# EAGLE design DueShieldTopOnly (EAGLE 8.0.1)
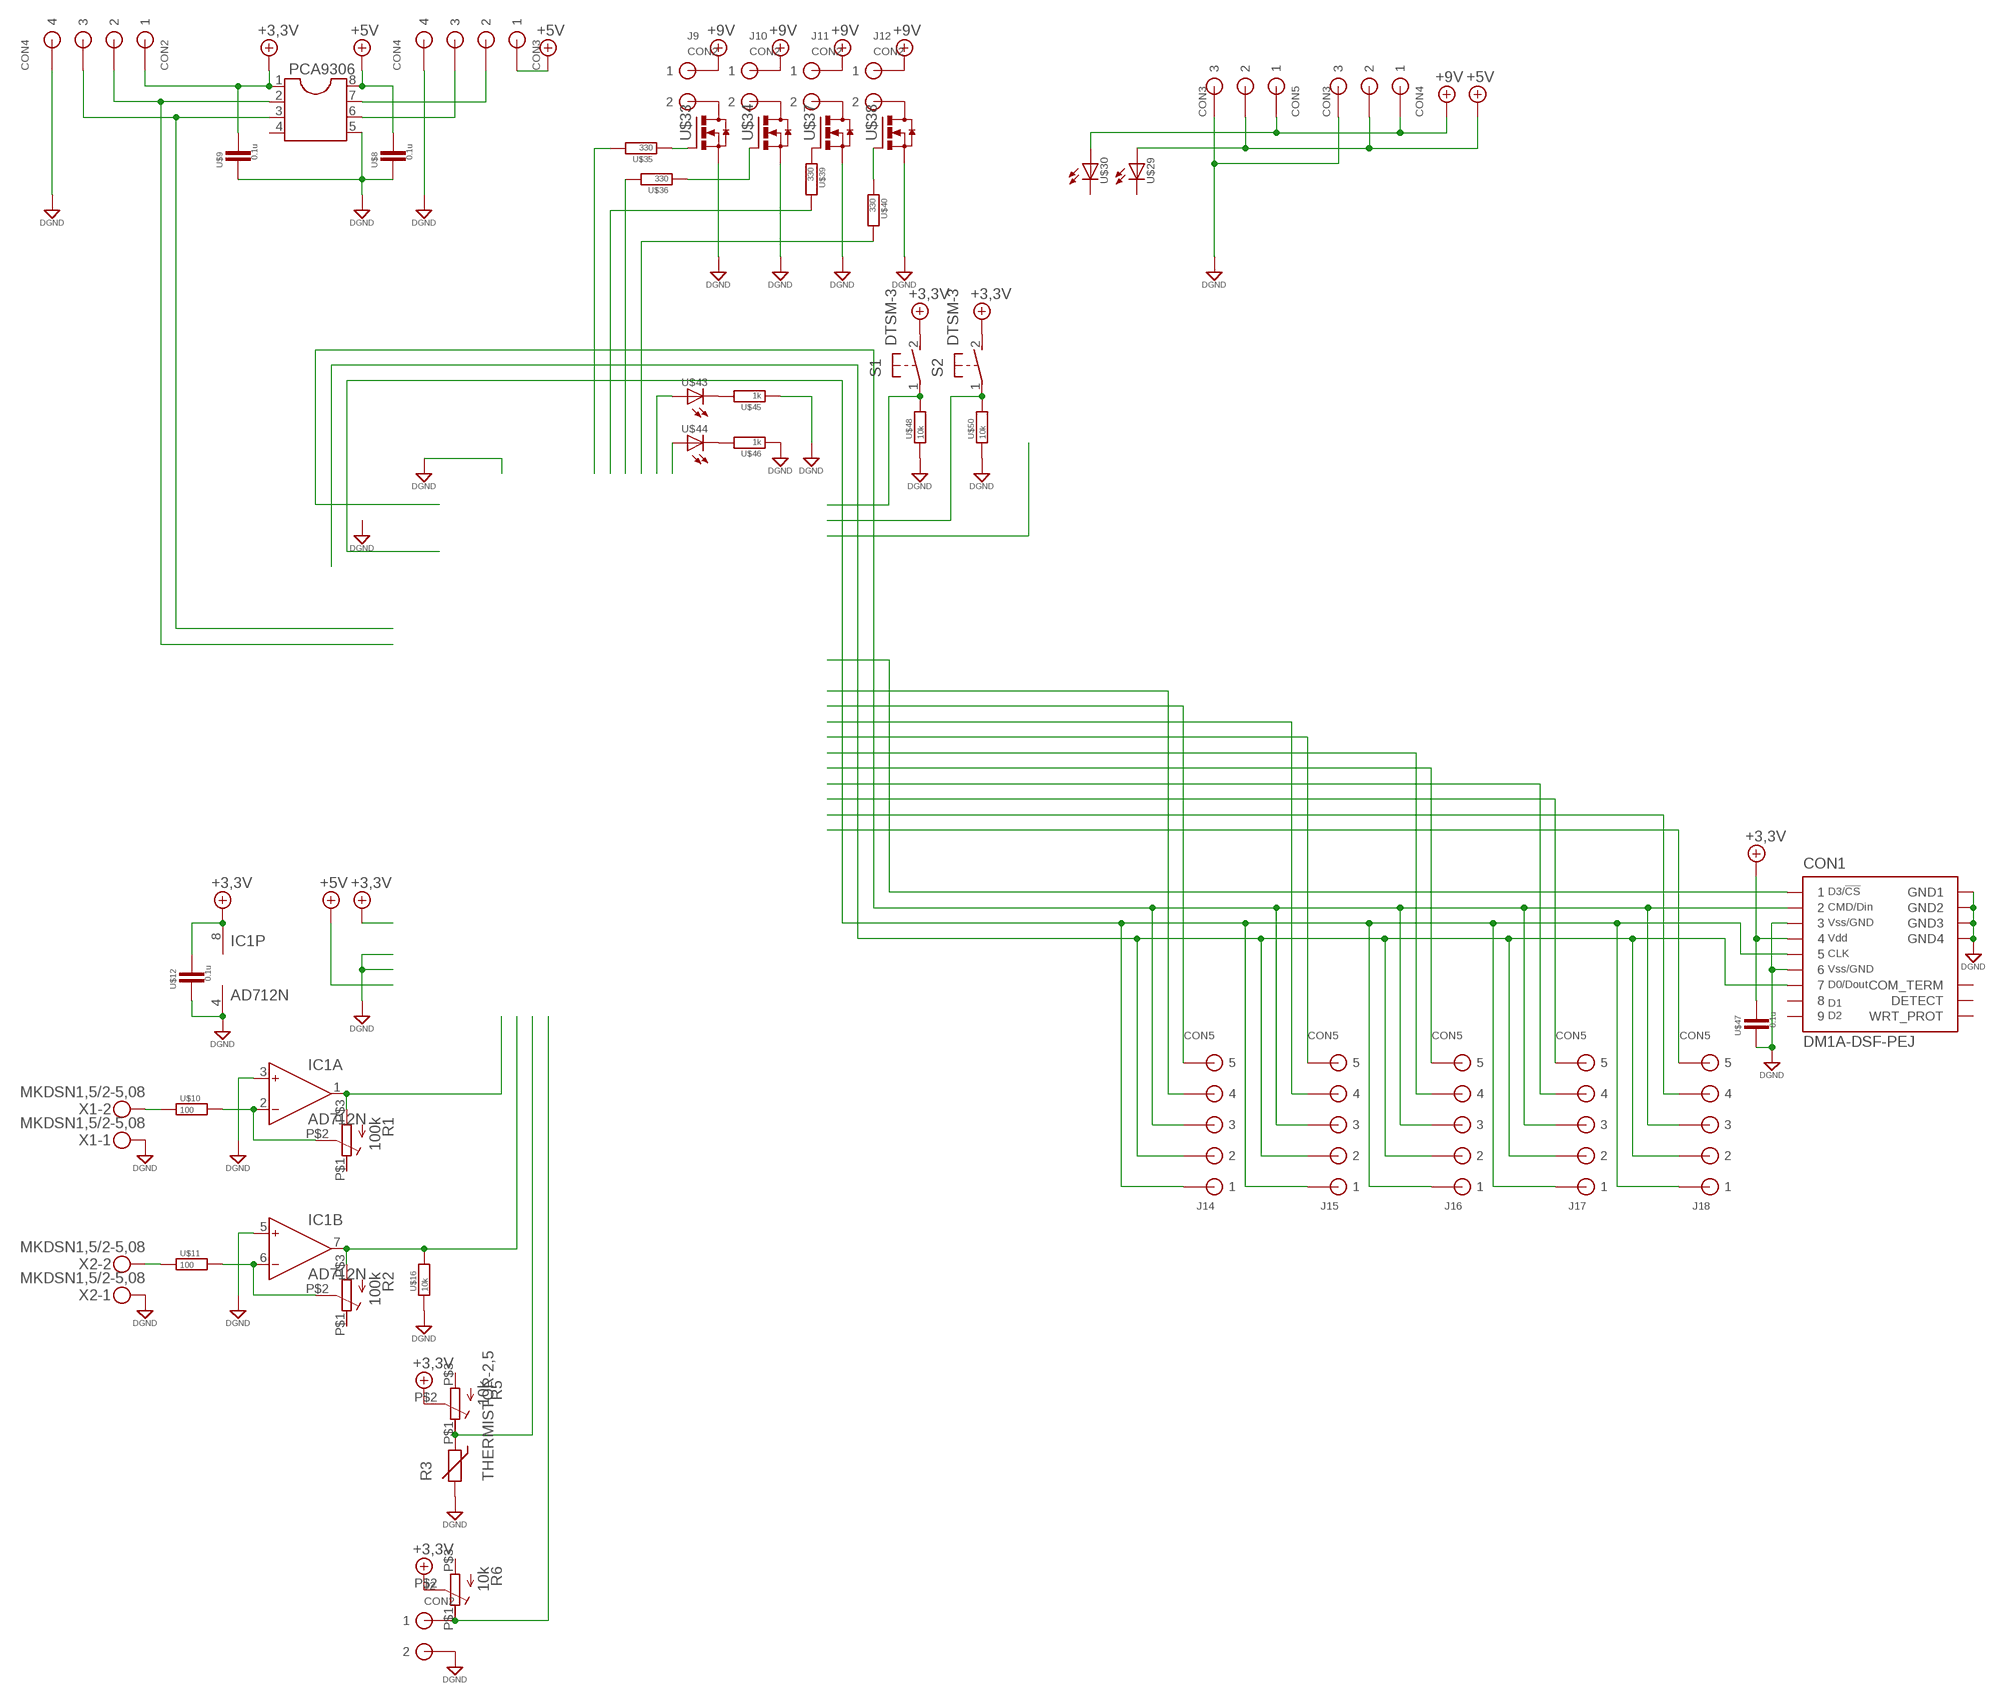
[diagram p0: schematic, sheet 1]

## Parts
CON1  DM1A-DSF-PEJ  [DM1A-DSF-PEJ]
CON2  CON4  [CON4]
CON3  CON4  [CON4]
CON4  CON3  [CON3]
CON5  CON3  [CON3]
IC1  AD712N  [DIL08]
J2  CON2  [CON2]
J9  CON2  [CON2]
J10  CON2  [CON2]
J11  CON2  [CON2]
J12  CON2  [CON2]
J14  CON5  [CON5]
J15  CON5  [CON5]
J16  CON5  [CON5]
J17  CON5  [CON5]
J18  CON5  [CON5]
PCA9306  DIL8  [DIL08]
R1  100k  抵抗(可変)  [GF063PB]
R2  100k  抵抗(可変)  [GF063PB]
R3  THERMISTOR-2,5  [RS-2,5]
R5  10k  抵抗(可変)  [GF063PB]
R6  10k  抵抗(可変)  [GF063PB]
S1  DTSM-3  [DTSM-3]
S2  DTSM-3  [DTSM-3]
U$8  0.1u  コンデンサ0805  [0805]
U$9  0.1u  コンデンサ0805  [0805]
U$10  100  抵抗0805  [0805]
U$11  100  抵抗0805  [0805]
U$12  0.1u  コンデンサ0805  [0805]
U$16  10k  抵抗0805  [0805]
U$29  LED(砲弾型)3  [LED3MM]
U$30  LED(砲弾型)3  [LED3MM]
U$33  TO-252(MOS-FET_N)  [TO-252]
U$34  TO-252(MOS-FET_N)  [TO-252]
U$35  330  抵抗0805  [0805]
U$36  330  抵抗0805  [0805]
U$37  TO-252(MOS-FET_N)  [TO-252]
U$38  TO-252(MOS-FET_N)  [TO-252]
U$39  330  抵抗0805  [0805]
U$40  330  抵抗0805  [0805]
U$43  LED(砲弾型)3  [LED3MM]
U$44  LED(砲弾型)3  [LED3MM]
U$45  1k  抵抗0805  [0805]
U$46  1k  抵抗0805  [0805]
U$47  0.1u  コンデンサ0805  [0805]
U$48  10k  抵抗0805  [0805]
U$50  10k  抵抗0805  [0805]
X1  MKDSN1,5/2-5,08  [MKDSN1,5/2-5,08]
X2  MKDSN1,5/2-5,08  [MKDSN1,5/2-5,08]

## Nets
+3.3V: CON1.4 CON2.P$1 IC1.8(P:V+) PCA9306.1 R5.P$2(S) R6.P$2(S) S1.2 S2.2 U$9.1 U$12.1 U$47.1 ; supply symbol labelled +3,3V
+5V: CON3.P$1 CON4.P$2 CON5.P$2 PCA9306.8 U$8.1 U$29.A
+5V1: U$43.A
+9V: CON4.P$1 CON5.P$1 J9.P$1 J10.P$1 J11.P$1 J12.P$1 U$30.A
+9V1: U$44.A
DGND: CON1.3 CON1.6 CON1.GND1 CON1.GND2 CON1.GND3 CON1.GND4 CON2.P$4 CON3.P$4 CON4.P$3 CON5.P$3 IC1.3(A:IN+) IC1.4(P:V-) IC1.5(B:IN+) J2.P$2 PCA9306.5 R3.2 U$8.2 U$9.2 U$12.2 U$16.1 U$33.2(S) U$34.2(S) U$37.2(S) U$38.2(S) U$45.1 U$46.1 U$47.2 U$48.1 U$50.1 X1.1 X2.1
N$2: CON1.7 J14.P$2 J15.P$2 J16.P$2 J17.P$2 J18.P$2
N$3: S1.1 U$48.2
N$4: CON1.1
N$5: CON2.P$2 PCA9306.2
N$6: CON1.5 J14.P$1 J15.P$1 J16.P$1 J17.P$1 J18.P$1
N$7: CON2.P$3 PCA9306.3
N$8: CON3.P$2 PCA9306.7
N$9: CON3.P$3 PCA9306.6
N$10: IC1.2(A:IN-) R1.P$2(S) U$10.2
N$11: IC1.6(B:IN-) R2.P$2(S) U$11.2
N$13: U$11.1 X2.2
N$14: U$10.1 X1.2
N$15: J2.P$1 R6.P$1(E)
N$17: IC1.1(A:OUT) R1.P$3(A)
N$18: IC1.7(B:OUT) R2.P$3(A) U$16.2
N$19: R3.1 R5.P$1(E)
N$25: U$35.2
N$26: U$36.2
N$27: U$39.2
N$28: U$40.2
N$31: U$43.K U$45.2
N$32: U$33.1(G) U$35.1
N$33: U$34.1(G) U$36.1
N$34: J9.P$2 U$33.3(D)
N$35: J10.P$2 U$34.3(D)
N$36: U$37.1(G) U$39.1
N$37: U$38.1(G) U$40.1
N$38: J11.P$2 U$37.3(D)
N$39: J12.P$2 U$38.3(D)
N$40: U$44.K U$46.2
N$41: J14.P$4
N$42: J14.P$5
N$43: CON1.2 J14.P$3 J15.P$3 J16.P$3 J17.P$3 J18.P$3
N$44: S2.1 U$50.2
N$46: J15.P$5
N$48: J15.P$4
N$50: J16.P$4
N$51: J16.P$5
N$55: J17.P$4
N$56: J17.P$5
N$60: J18.P$4
N$61: J18.P$5
Unconnected: CON1.8 CON1.9 CON1.COM_TERM CON1.DETECT CON1.WRT_PROT PCA9306.4 R1.P$1(E) R2.P$1(E) R5.P$3(A) R6.P$3(A) U$29.K U$30.K

## Library data of the parts
CON1 = (スロット)SDカード:DM1A-DSF-PEJ: HIROSE DM1A
CON2 CON3 = (コネクタ)XH:CON4: Low insertion connector 4pin
CON4 CON5 = (コネクタ)XH:CON3: low insertion CON
IC1 = analog-devices:AD712: Dual Precision, Low Cost, High Speed BiFET Op Amp Source: http://www.analog.com/static/imported-files/data_sheets/AD712.pdf; MF: ALTERA CORPORATION; MPN: AD712JNZ; OC_FARNELL: 9604898; OC_NEWARK: 59K4554
J2 J9-J12 = (コネクタ)XH:CON2: low insertion CON
J14-J18 = (コネクタ)XH:CON5: Low insertion connector 5P
PCA9306 = (半導体)汎用DIP:DIL8: Dual In Line / Socket
R1 R2 R5 R6 = (抵抗)可変抵抗:抵抗(可変): Trimm resistor
R3 = varistor:THERMISTOR: THERMISTOR
S1 S2 = (スイッチ)タクトスイッチ2:DTSM-3
U$8 U$9 U$12 U$47 = (Foundation)表面実装RC:コンデンサ
U$10 U$11 U$16 U$35 U$36 U$39 U$40 U$45 U$46 U$48 U$50 = (Foundation)表面実装RC:抵抗
U$29 U$30 U$43 U$44 = (半導体)LED:LED(砲弾型)
U$33 U$34 U$37 U$38 = (半導体)FET＆トランジスタ:TO-252(MOS-FET_N)
X1 X2 = con-phoenix-508:MKDSN1,5/2-5,08: MKDSN 1,5/ 2-5,08 Printklemme Nennstrom: 13,5 A Nennspannung: 250 V Rastermaß: 5,08 mm Polzahl: 2 Anschlussart: Schraubanschluss Montage: Löten Anschlussrichtung Leiter/Platine: 0 ° Artikelnummer: 1729128 Source: http://eshop.phoenixcontact.com .. 1729128.pdf

## Board
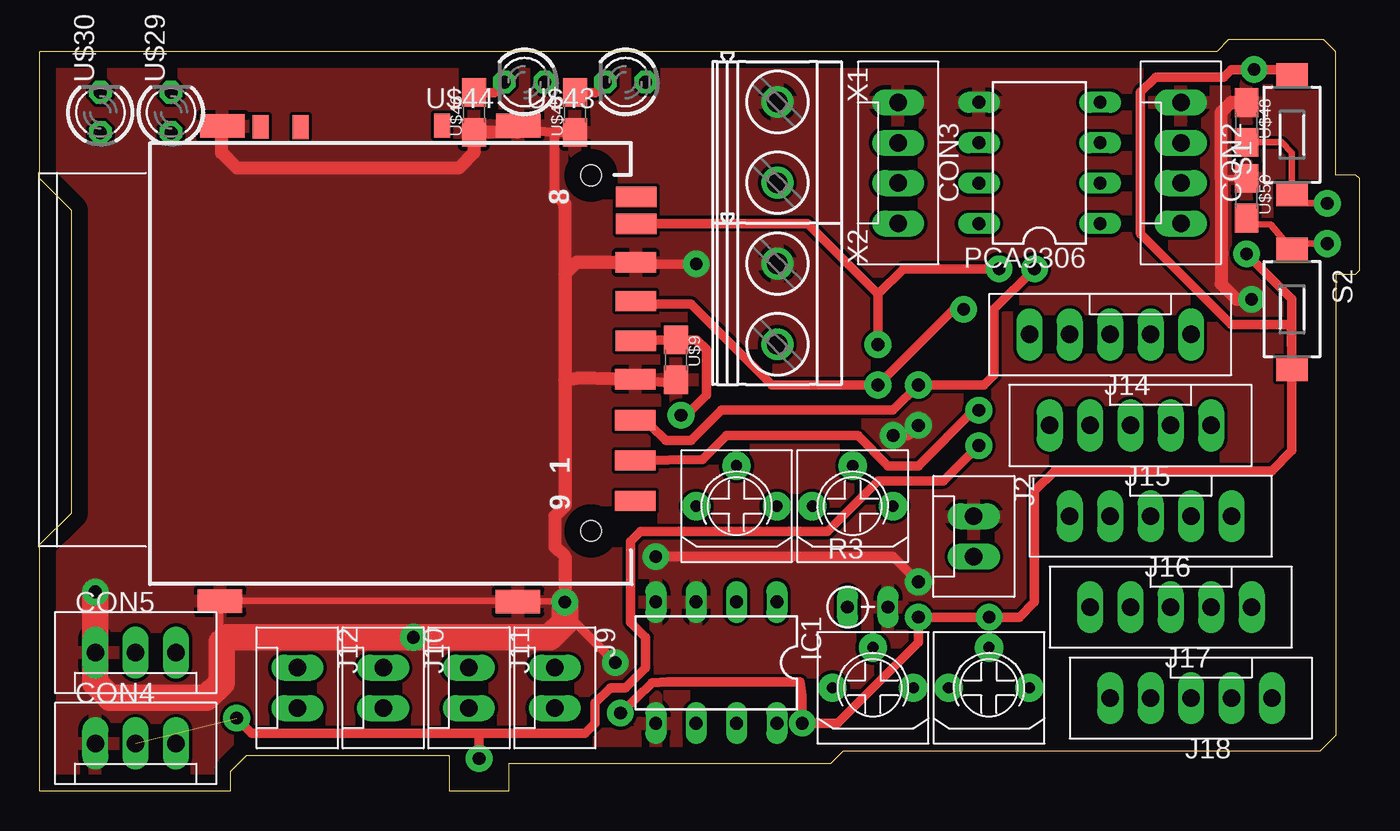
[diagram p1: board, top side]
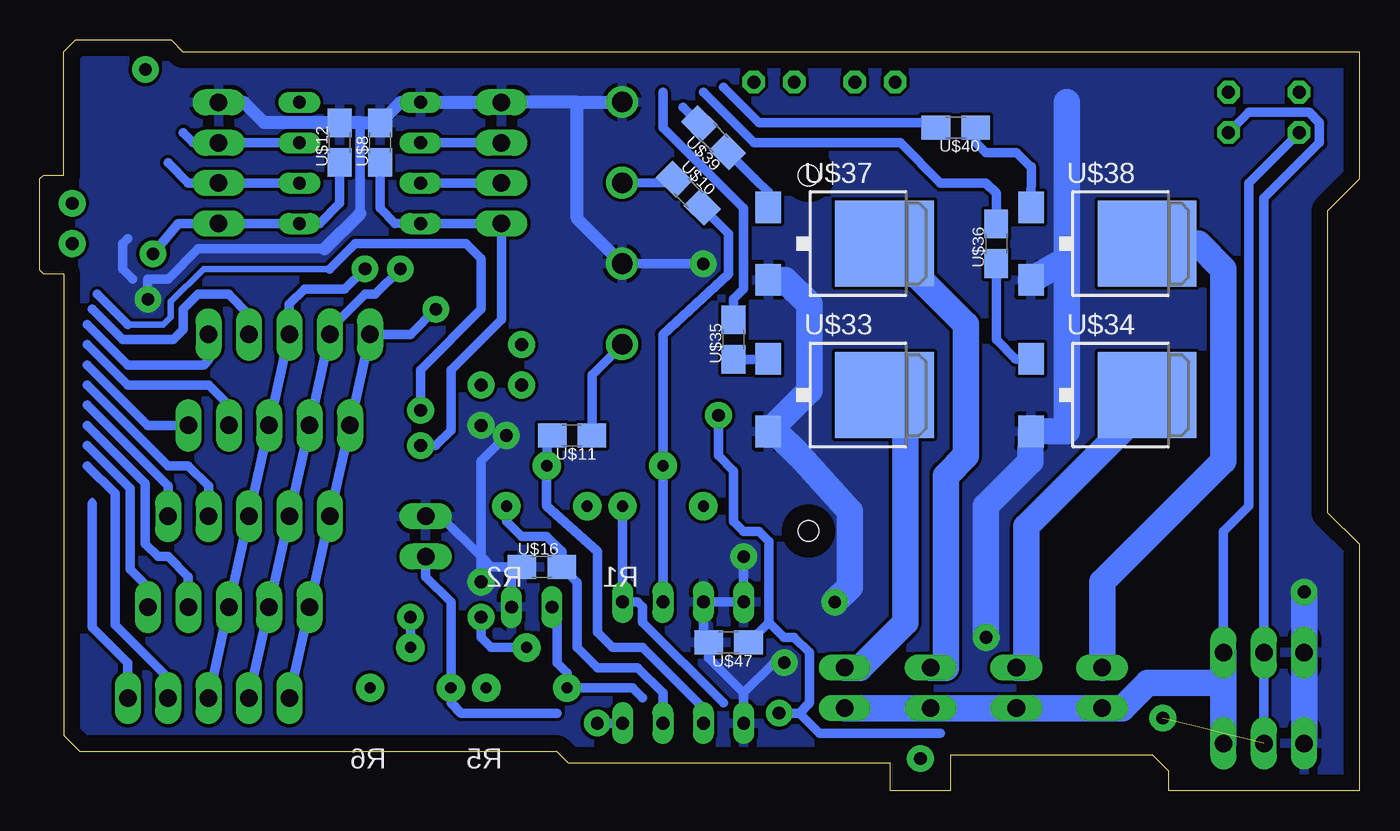
[diagram p2: board, bottom side, seen from below]

Size 83 x 47.25 mm. Coordinates in mm from the lower left corner, seen from the top.
Outline: 0,0 0,15.5 2,17.5 2,36.5 0,38.5 0,46.5 74,46.5 74.75,47.25 80.75,47.25 81.5,46.5 81.5,38.75 82.75,38.75 83,38.5 83,32.75 82.75,32.5 81.5,32.5 81.5,3.5 80.5,2.5 50.5,2.5 49.75,1.75 29.5,1.75 29.5,0 25.75,0 25.75,2.25 13,2.25 12,1.25 12,0 0,0
Copper layers (1*16): Top 0.035mm / dielectric 1.5mm / Bottom 0.035mm
Design rules "default": minimum track width 10mil, minimum drill 24mil, track to track 8mil, track to pad 8mil, pad to pad 8mil, via to via 8mil, smd to smd 8mil, copper to edge 40mil, drill to drill 8mil, minimum pad ring 10mil, minimum via ring 8mil, stop-mask expansion 4mil, vias tented up to drill 0mil, thermal gap 10mil

### Footprints (pad centres in the part's own frame; a part is rotated, then mirrored left to right if it is on the bottom)
DM1A-DSF-PEJ = smd 1.27 x 2.54: 1 6.013,16.809; 2 3.488,16.809; 3 0.911,16.813; 4 -1.516,16.84; 5 -4.016,16.84; 6 -6.44,16.84; 7 -8.865,16.866; 8 -10.565,16.866; 9 8.564,16.809 | smd 1.5 x 1: COM_TERM -14.962,-6.752; DETECT -15.032,4.652; WRT_PROT -14.937,-4.238 | smd 1.5 x 2.8: GND1 14.895,9.427; GND2 -15.049,9.452; GND3 -15.023,-9.152; GND4 14.859,-9.305 | hole 1.295: -11.913,14.021; 10.439,14.021
CON4 = drill 1.1 long: P$1 3.81,0; P$2 1.27,0; P$3 -1.27,0; P$4 -3.81,0
CON3 = drill 1.1 long: P$1 2.54,0; P$2 0,0; P$3 -2.54,0
DIL08 = drill 0.813 long: 1 -3.81,-3.81; 2 -1.27,-3.81; 3 1.27,-3.81; 4 3.81,-3.81; 5 3.81,3.81; 6 1.27,3.81; 7 -1.27,3.81; 8 -3.81,3.81
CON2 = drill 1.1 long: P$1 1.27,0; P$2 -1.27,0
CON5 = drill 1.1 long: P$1 5.08,0; P$2 2.54,0; P$3 0,0; P$4 -2.54,0; P$5 -5.08,0
GF063PB = drill 0.7 pad 1.778: P$1 0,2.54; P$2 2.54,0; P$3 0,-2.54
RS-2,5 = drill 0.813 long: 1 -1.27,0; 2 1.27,0
DTSM-3 = smd 1.5 x 2: 1 -3.75,0; 2 3.75,0
0805 = smd 1.8 x 1.5: 1 -1.25,0; 2 1.25,0
LED3MM = drill 0.813 pad 1.422 octagon: A -1.27,0; K 1.27,0
TO-252 = smd 2 x 1.6: 1 -2.28,-4.8; 2 2.28,-4.8 | smd 5.4 x 6.2: 3 0,2.5
MKDSN1,5/2-5,08 = drill 1.3 pad 2: 1 -2.561,0.025; 2 2.519,0.025

### Placement (x,y rotation side)
CON1  20.64,26.8 270 top
CON2  71.75,39.51 270 top
CON3  53.98,39.51 270 top
CON4  6.03,2.99 0 top
CON5  6.03,8.71 0 top
IC1  42.55,8.07 180 top
J2  58.74,16.01 270 top
J9  32.38,6.49 270 top
J10  21.59,6.49 270 top
J11  26.99,6.49 270 top
J12  16.19,6.49 270 top
J14  67.31,28.71 180 top
J15  68.58,23 180 top
J16  69.85,17.28 180 top
J17  71.12,11.56 180 top
J18  72.39,5.85 180 top
PCA9306  62.87,39.51 90 top
R1  43.81,17.91 90 top
R2  51.12,17.91 90 top
R3  52.07,11.56 0 top
R5  52.39,6.49 90 top
R6  59.69,6.49 90 top
S1  78.74,41.27 90 top
S2  78.74,30.3 270 top
U$8  61.59,40.77 90 bottom
U$9  40.01,27.12 270 top
U$10  42.23,37.6 315 bottom
U$11  49.53,22.36 180 bottom
U$12  64.14,40.77 90 bottom
U$16  51.44,14.11 0 bottom
U$29  8.26,42.68 90 top
U$30  3.81,42.68 90 top
U$33  32.38,24.9 270 bottom
U$34  15.88,24.9 270 bottom
U$35  39.37,28.39 90 bottom
U$36  22.86,34.42 90 bottom
U$37  32.38,34.42 270 bottom
U$38  15.88,34.42 270 bottom
U$39  40.64,41.09 135 bottom
U$40  25.4,41.73 180 bottom
U$43  36.83,44.59 180 top
U$44  30.48,44.59 180 top
U$45  33.66,42.68 90 top
U$46  27.3,42.68 90 top
U$47  39.69,9.34 180 bottom
U$48  75.88,42.05 270 top
U$50  75.88,37.28 270 top
X1  46.35,40.77 270 top
X2  46.35,30.61 270 top

### Tracks (layer width: path | path; a pad name or v marks a point on that pad's centre or on a via)
+3.3V  (via drill 0.8 pad 1.68)
  Top 0.61: S2.2 78.74,30.93 v75.88,33.79 | S2.2 78.74,21.41 77.47,20.14 63.82,20.14 62.55,18.87 62.55,11.88 61.59,10.93 v59.69,10.93 v55.24,10.93 55.24,9.34 50.16,4.26 v47.94,4.26 47.94,5.99 47.81,6.86 39.47,6.86 38.51,6.81 v36.51,4.9 | CON1.4 37.53,28.37 U$9.1 41.3,28.37 41.91,27.76 41.91,24.9 40.64,23.63 v40.32,23.63 | 78.74,44.74 78.84,44.68 S1.2 77.89,45.38 v76.36,45.38 74.93,45.38 74.45,44.9 70.17,44.9 69.22,43.95 69.22,35.06 74.93,29.34 78.68,29.34 S2.2
  Bottom 0.61: U$12.1 64.14,36.97 65.41,35.7 66.66,35.72 PCA9306.1 CON2.P$1 74.3,35.7 v75.88,33.79 | 26.35,3.63 33.97,3.63 35.24,4.9 | v40.32,23.63 40.32,21.09 39.37,20.14 39.37,16.96 38.73,16.33 37.78,16.33 37.15,15.69 37.15,10.61 | 35.24,4.9 v36.51,4.9 | R6.P$2 v59.69,10.93 | v55.24,10.93 55.24,9.66 54.61,9.03 R5.P$2 | IC1.8 v47.94,4.26 | 37.15,10.61 U$47.1 | 35.24,4.9 34.61,5.53 34.61,8.71 35.56,9.66 36.2,9.66 37.15,10.61
+5V  (via drill 0.8 pad 1.68)  (1 unrouted)
  Top 0.61: v59.05,21.73 56.83,19.5 52.7,19.5 49.53,16.33 37.78,16.33 37.15,15.69 37.15,10.61 38.1,9.66 38.1,7.76 36.83,6.49 35.88,6.49 34.92,5.53 34.92,4.26 34.29,3.63 27.62,3.63 | 27.62,3.63 v27.62,2.04 | v12.38,4.58 13.34,3.63 27.62,3.63
  Bottom 0.61: U$8.1 61.59,36.65 60.64,35.7 59.08,35.72 PCA9306.8 CON3.P$1 53.98,29.66 57.15,26.49 57.15,22.68 58.1,21.73 v59.05,21.73 | U$29.A 6.99,42.68 3.17,42.68 2.54,42.05 2.54,40.77 6.03,37.28 CON5.P$2 CON4.P$2 6.03,1.72
+9V
  Bottom 0.61: CON5.P$1 8.57,16.33 6.99,17.91 6.99,38.23 U$30.A
  Bottom 1.676: J9.P$1 J11.P$1 J10.P$1 J12.P$1 14.92,5.21 13.34,6.8 8.57,6.8 | 8.57,6.8 CON4.P$1 | 8.57,6.8 CON5.P$1
DGND  (via drill 0.8 pad 1.68)
  Top 0.406: 11.43,9.34 11.33,9.76 CON1.GND4 30.03,11.95 | CON1.GND1 32.99,11.91 | U$50.1 75.58,38.53 74.3,38.55
  Top 0.61: 37.55,33.18 CON1.6 38.33,33.24 38.42,33.16 v41.27,33.16 | U$9.2 39.78,25.64 CON1.3 37.34,25.54 | 30.03,11.95 CON1.GND1 | v36.2,8.07 33.02,11.25 v33.02,11.88 | v53.66,22.36 54.61,22.36 v55.24,23 | v55.24,13.15 53.66,14.74 v38.73,14.74 | 32.38,37.6 32.38,41.41 | 32.38,41.41 32.41,41.43 U$45.1 | 32.38,41.41 30.11,41.67 CON1.GND2
  Top 0.813: 30.09,11.88 CON1.GND1 | CON1.3 33.76,25.96 33.02,25.85 | 33.02,25.85 33.02,17.91 32.38,17.28 32.38,15.38 33.02,14.74 v33.02,11.88 | CON1.6 33.74,33.24 33.02,32.52 | 33.02,32.52 33.02,25.85 | 33.02,32.52 33.02,36.97 32.38,37.6 | CON1.GND2 30.01,41.43 U$46.1 27.3,40.14 26.35,39.19 12.38,39.19 11.43,40.14 11.43,41.27 CON1.GND3 | U$48.1 74.91,43.31 74.3,42.68 74.3,38.55 74.3,31.88 75.25,30.93 v76.2,30.93
  Top 1.676: 32.99,11.91 v33.02,11.88 33.02,10.61 32.07,9.66 v23.5,9.66 11.75,9.66 11.43,9.34 11.43,6.8 10.48,5.85 4.45,5.85 3.49,6.8 CON5.P$3 v3.49,12.52
  Bottom 0.61: R3.2 53.34,13.45 U$16.1 54.61,14.11 55.24,14.74 | 62.87,36.33 62.87,42.05 | X2.1 41.3,33.18 v41.27,33.16 | IC1.5 38.73,6.17 | 38.73,6.17 40.96,8.39 40.96,9.01 U$47.2 40.94,9.66 41.27,9.66 IC1.3 IC1.4 v38.73,14.74 | 38.73,6.17 36.83,8.07 v36.2,8.07 | v53.66,22.36 55.24,20.77 55.24,14.74 | J2.P$2 57.78,17.28 55.24,14.74 | 55.24,14.74 v55.24,13.15 | 65.09,34.11 73.03,34.11 74.93,32.2 76.2,32.2 v76.2,30.93 | 77.15,32.2 77.79,32.84 77.79,34.42 77.47,34.74
  Bottom 0.813: 62.87,36.33 65.09,34.11 | U$12.2 64.16,42.05 | 64.16,42.05 64.16,42.06 65.09,42.05 68.9,42.05 70.17,43.31 CON2.P$4 | 64.16,42.05 62.87,42.05 61.62,42.05 U$8.2 61.59,42.05 60.33,43.31 PCA9306.5 CON3.P$4 49.21,43.31 | 49.21,43.31 46.4,43.31 X1.1 | X2.1 49.21,36.01 49.21,43.31
  Bottom 1.676: U$38.2 18.99,33.1 18.41,33.16 | 18.41,33.16 18.41,22.66 U$34.2 20.7,20.71 23.5,17.91 v23.5,9.66 | U$37.2 36.14,32.15 34.61,30.61 34.61,25.2 U$33.2 36.77,22.62 35.24,21.09 32.07,17.6 32.07,12.84 v33.02,11.88 | CON4.P$3 CON5.P$3 v3.49,12.52 | 18.41,33.16 18.41,43.31
  pour Bottom: -0.36,56.65 -0.05,-7.49 99.38,-7.49 99.06,56.65
  pour Top: -1.64,58.24 -1.64,-8.76 100.65,-8.76 100.65,58.24
N$2  (via drill 0.8 pad 1.68)
  Top 0.61: 52.7,31.25 52.7,29.03 v52.7,28.07 | 52.7,31.25 48.26,35.7 37.53,35.7 CON1.7 | v60.33,32.84 54.29,32.84 52.7,31.25
  Bottom 0.61: J18.P$2 J17.P$2 J16.P$2 J15.P$2 J14.P$2 64.77,29.66 64.14,29.66 62.55,31.25 61.91,31.25 v60.33,32.84
N$3  (via drill 0.8 pad 1.68)
  Top 0.406: v80.96,36.97 78.8,36.97 S1.1 78.74,40.14 78.08,40.8 U$48.2
N$4  (via drill 0.8 pad 1.68)
  Top 0.61: CON1.1 41.68,20.86 43.18,22.36 51.44,22.36 53.34,20.45 55.24,20.45 58.74,23.95 v59.05,23.95
  Bottom 0.406: 77.47,29.34 75.25,29.34 74.77,29.82 74.77,30.77 72.71,32.84 64.77,32.84
  Bottom 0.61: 79.38,31.25 77.47,29.34 | 64.77,32.84 63.18,34.42 56.2,34.42 55.24,33.47 55.24,30.3 59.05,26.49 v59.05,23.95
N$5
  Bottom 0.61: 74.93,39.51 73.66,38.23 CON2.P$2 PCA9306.2
N$6  (via drill 0.8 pad 1.68)
  Top 0.61: CON1.5 37.68,30.61 40.96,30.61 46.04,25.54 v52.7,25.54 57.47,30.3 | 57.47,30.3 v58.1,30.3 57.47,30.3
  Bottom 0.61: J18.P$1 J17.P$1 J16.P$1 J15.P$1 J14.P$1 59.69,28.71 v58.1,30.3
N$7
  Bottom 0.61: 73.98,41.41 73.34,40.77 CON2.P$3 PCA9306.3
N$8
  Bottom 0.61: CON3.P$2 PCA9306.7
N$9
  Bottom 0.61: PCA9306.6 CON3.P$3
N$10
  Bottom 0.61: IC1.2 R1.P$2 43.81,28.71 39.69,32.52 39.69,35.06 U$10.2 | U$10.2
N$11
  Bottom 0.61: U$11.2 51.1,22.06 R2.P$2 51.12,17.91 47.94,15.06 47.94,9.98 46.99,9.03 45.09,9.03 41.27,5.21 IC1.6
N$13
  Bottom 0.61: X2.2 46.38,28.05 48.26,26.17 48.26,22.38 U$11.1
N$14
  Bottom 0.61: X1.2 45.74,38.26 43.5,38.23 U$10.1
N$15
  Bottom 0.61: 50.48,4.9 56.52,4.9 57.15,5.53 R6.P$1 57.15,11.88 58.74,13.47 J2.P$1
N$17
  Bottom 0.61: 40.01,5.53 45.09,10.61 45.09,11.56 45.4,11.88 IC1.1 R1.P$3
N$18
  Bottom 0.61: R2.P$3 53.66,16.96 52.7,16.01 51.12,16.01 50.16,15.06 U$16.2 49.21,13.13 49.21,9.03 47.94,7.76 45.4,7.76 43.81,6.17 IC1.7
N$19
  Bottom 0.61: 45.09,5.85 45.72,6.49 R5.P$1 49.85,7.44 50.48,8.07 50.48,10.93 50.8,11.25 R3.1
N$25
  Bottom 0.61: 43.81,43.95 43.81,41.73 38.73,36.65 38.73,31.57 39.37,30.93 U$35.2 39.37,29.32
N$26
  Bottom 0.61: 41.27,43.95 38.1,40.77 28.89,40.77 26.35,38.23 23.5,38.23 22.86,37.6 U$36.2
N$27
  Bottom 0.61: 42.55,43.02 U$39.2
N$28
  Bottom 0.61: 40.01,44.27 37.78,42.05 26.97,42.05 U$40.2
N$31
  Top 0.61: U$45.2 34.95,43.93 U$43.K
N$32
  Bottom 0.61: U$35.1 38.17,27.14 U$33.1
N$33
  Bottom 0.61: U$34.1 21.65,27.18 22.86,28.39 U$36.1
N$34
  Bottom 1.676: J9.P$2 31.43,7.76 28.57,10.61 28.57,23.31 29.21,23.95 31.75,23.99 U$33.3
N$35
  Bottom 1.676: J10.P$2 20.95,7.76 20.95,16.64 12.06,25.54 12.06,24.86 U$34.3
N$36
  Bottom 0.61: U$39.1 38.1,38.55 37.17,37.67 U$37.1
N$37
  Bottom 0.61: U$40.1 24.13,40.77 23.5,40.14 21.59,40.14 20.71,39.26 20.66,39.26 U$38.1
N$38
  Bottom 1.676: J11.P$2 26.04,7.76 26.04,19.82 24.77,21.09 24.77,29.34 29.17,33.75 29.53,33.75 U$37.3
N$39
  Bottom 1.676: J12.P$2 16.19,13.15 8.57,20.77 8.57,32.84 10.16,34.42 U$38.3
N$40
  Top 0.61: U$46.2 28.59,43.93 U$44.K
N$41
  Bottom 0.61: 79.69,30.3 77.79,28.39 74.61,28.39 73.98,29.03 73.98,30.3 73.03,31.25 71.12,31.25 69.85,29.98 J14.P$4
N$42
  Bottom 0.61: J14.P$5 72.39,27.12 72.71,26.8 77.47,26.8 80.01,29.34
N$43  (via drill 0.8 pad 1.68)
  Top 0.61: 37.47,23 CON1.2 37.52,23 38.42,23 39.37,22.04 40.96,22.04 42.86,23.95 53.66,23.95 v55.24,25.54 59.37,25.54 60.01,26.17 60.01,30.3 v62.55,32.84
  Bottom 0.61: J18.P$3 J17.P$3 J16.P$3 J15.P$3 J14.P$3 67.31,30.61 66.36,31.57 63.82,31.57 v62.55,32.84
N$44  (via drill 0.8 pad 1.68)
  Top 0.406: U$50.2 75.88,35.7 77.41,35.63 S2.1 78.8,34.42 v80.96,34.42
N$46
  Bottom 0.61: J15.P$5 76.2,23 80.01,26.8
N$48
  Bottom 0.61: 80.01,28.07 77.47,25.54 72.39,25.54 71.12,24.27 J15.P$4
N$50
  Bottom 0.61: J16.P$4 72.39,19.18 73.66,20.45 74.93,20.45 80.01,25.54
N$51
  Bottom 0.61: 80.01,24.27 74.93,19.18 J16.P$5
N$55
  Bottom 0.61: J17.P$4 73.66,13.47 74.93,14.74 75.56,14.74 76.36,15.53 76.36,19.34 80.01,23
N$56
  Bottom 0.61: 80.01,21.73 77.31,19.03 77.31,13.95 76.2,12.84 J17.P$5
N$60
  Bottom 0.61: J18.P$4 74.93,7.12 78.26,10.45 78.26,18.71 80.01,20.45
N$61
  Bottom 0.406: 79.69,18.23 79.69,18.07
  Bottom 0.61: 79.69,18.07 79.69,10.29 77.47,8.07 J18.P$5